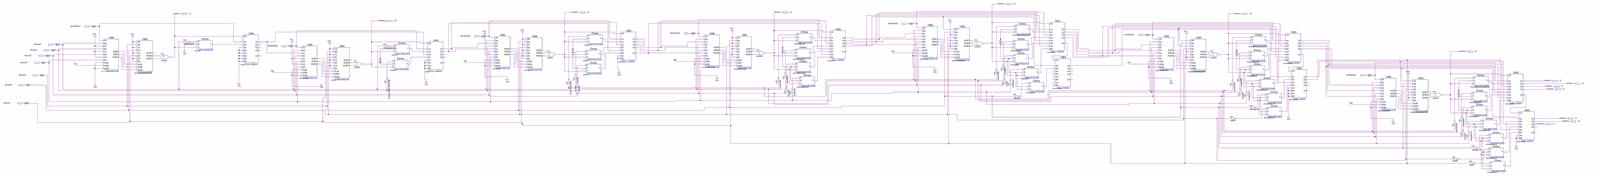
[diagram p0: schematic sheet, whole]
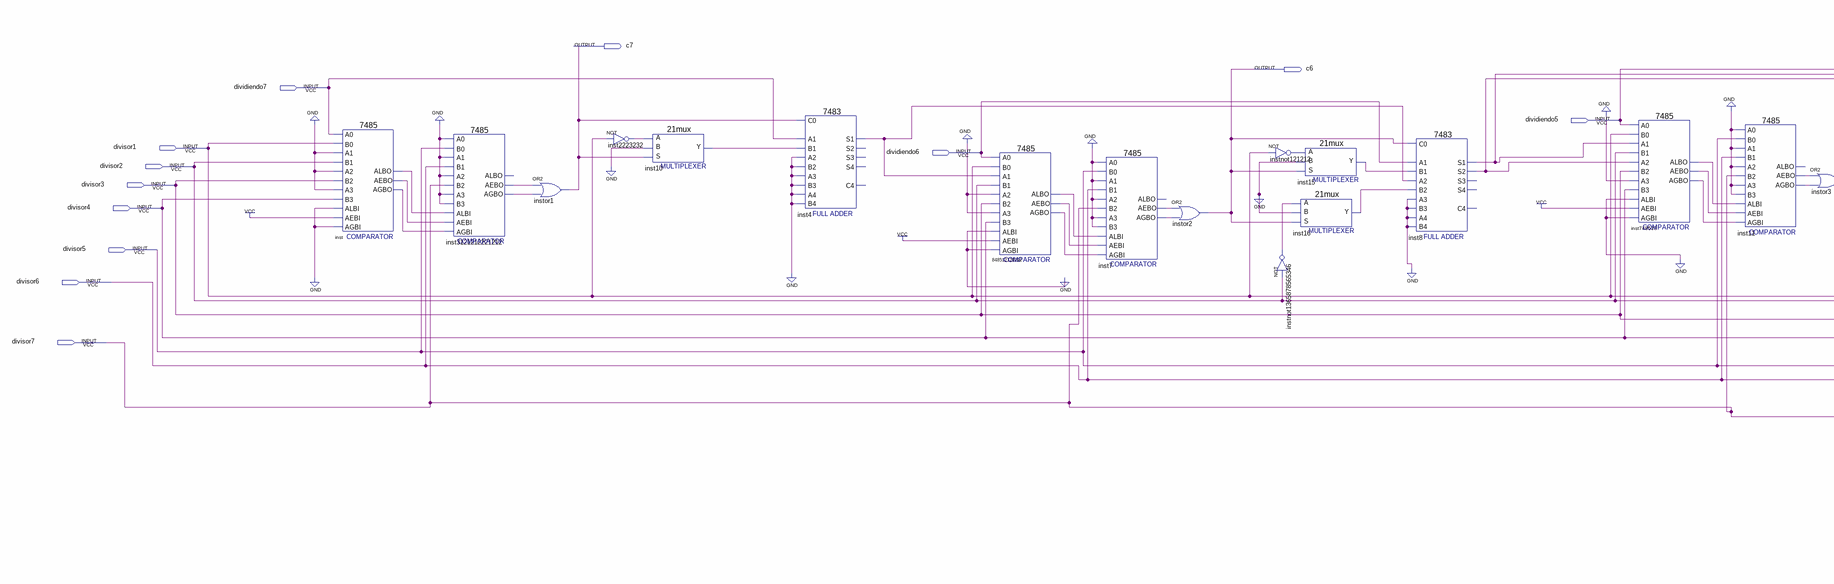
[diagram p1: schematic sheet, left part]
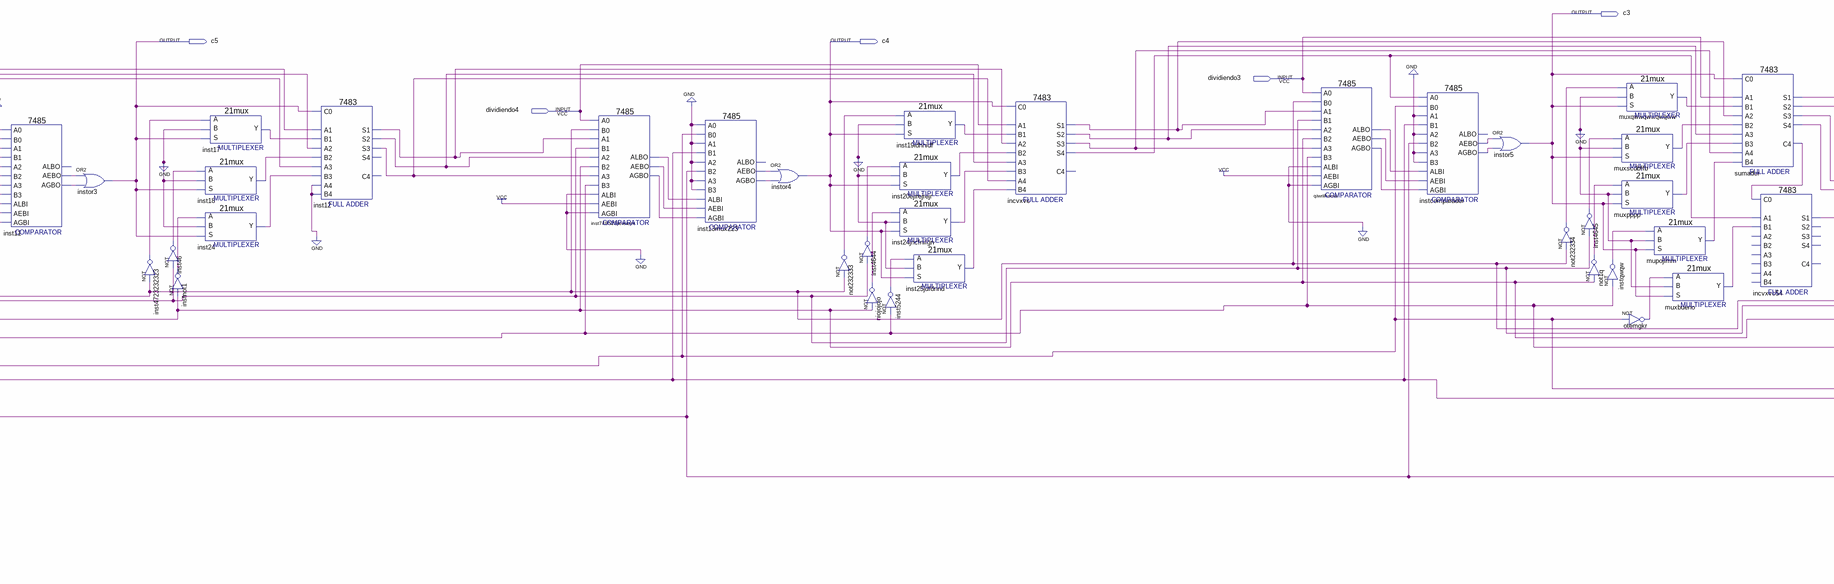
[diagram p2: schematic sheet, centre part]
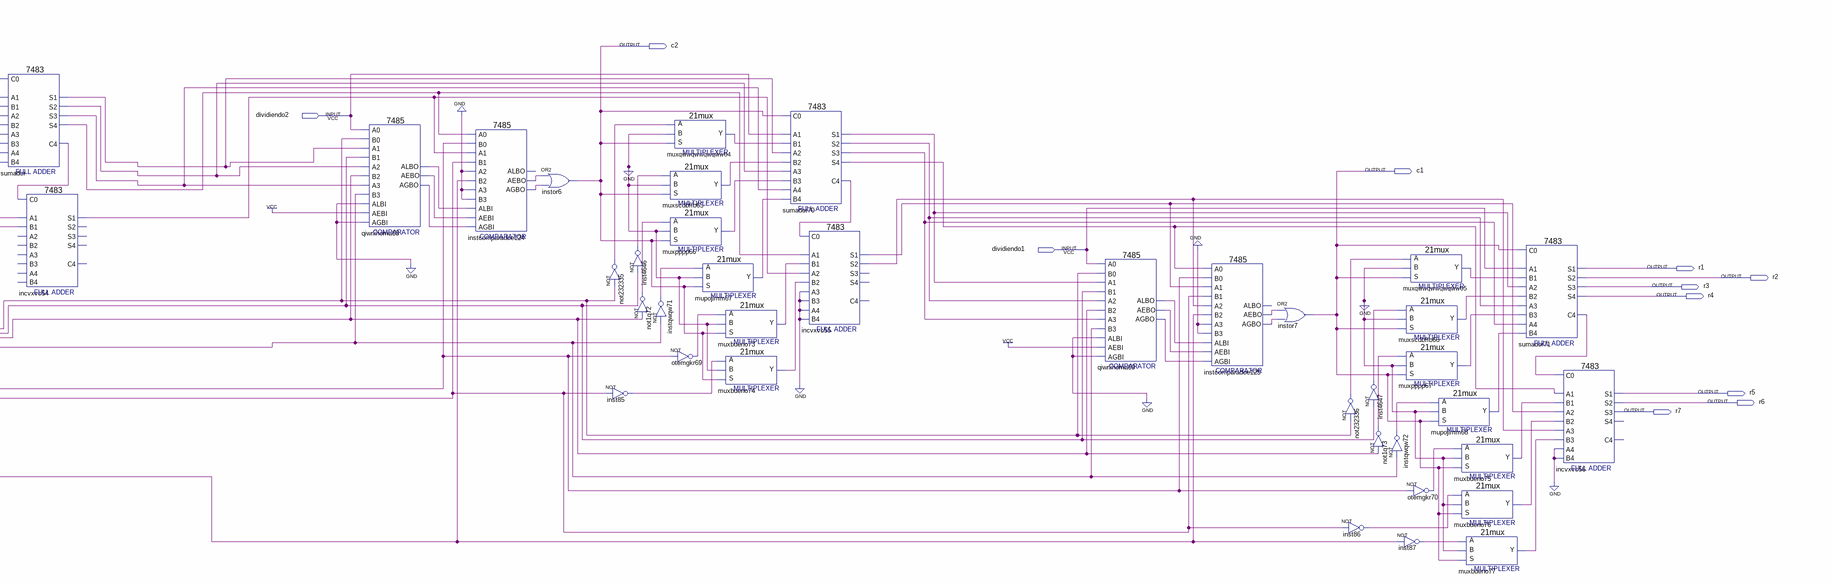
[diagram p3: schematic sheet, right part]
// Quartus schematic divisor.bdf as structural Verilog: 87 symbols, 28 pins
module divisor (
  input  dividiendo3,
  input  dividiendo7,
  input  dividiendo4,
  input  dividiendo2,
  input  dividiendo5,
  input  divisor1,
  input  dividiendo6,
  input  divisor2,
  input  divisor3,
  input  divisor4,
  input  divisor5,
  input  dividiendo1,
  input  divisor6,
  input  divisor7,
  output c3,
  output c5,
  output c4,
  output c7,
  output c2,
  output c6,
  output c1,
  output r1,
  output r2,
  output r3,
  output r4,
  output r5,
  output r6,
  output r7
);

  wire incvxvc54_s1, incvxvc55_s1, incvxvc55_s2, incvxvc_s1, incvxvc_s2, incvxvc_s3, incvxvc_s4, inst4_s1,
       inst7_aebo, inst7_agbo, inst8_s1, inst8_s2, inst10_y, inst11_aebo, inst11_agbo, inst12_s1, inst12_s2,
       inst12_s3, inst13mux223_aebo, inst13mux223_agbo, inst15_y, inst16_y, inst17_y, inst18_y,
       inst19idhhidf_y, inst20ejirejrejr_y, inst24_y, inst24jncfnifgn_y, inst25jdfdnnd_y, inst46_out,
       inst85_out, inst86_out, inst87_out, inst4644_out, inst4645_out, inst4646_out, inst4647_out,
       inst5244_out, inst748523_aebo, inst748523_agbo, inst748523_albo, inst748523jieieiejre_aebo,
       inst748523jieieiejre_agbo, inst748523jieieiejre_albo, inst2223232_out, inst4723232323_out,
       inst3121212221212_aebo, inst3121212221212_agbo, inst_aebo, inst_agbo, inst_albo,
       instcomparadoe124_aebo, instcomparadoe124_agbo, instcomparadoe125_aebo, instcomparadoe125_agbo,
       instcomparador_aebo, instcomparador_agbo, instnot1_out, instnot121212_out, instnot1365878565346_out,
       instqwqw71_out, instqwqw72_out, instqwqw_out, mupojimm67_y, mupojimm68_y, mupojimm_y, muxbueno73_y,
       muxbueno74_y, muxbueno75_y, muxbueno76_y, muxbueno77_y, muxbueno_y, muxpppp66_y, muxpppp67_y,
       muxpppp_y, muxqwwqwwqwqww64_y, muxqwwqwwqwqww65_y, muxqwwqwwqwqww_y, muxscdbffb65_y, muxscdbffb66_y,
       muxscdbffb_y, n848512121212_aebo, n848512121212_agbo, n848512121212_albo, niojojojo_out, not1q72_out,
       not1q73_out, not1q_out, not232333_out, not232334_out, not232335_out, not232336_out, otemgkr69_out,
       otemgkr70_out, otemgkr_out, qiwriihoma68_aebo, qiwriihoma68_agbo, qiwriihoma68_albo,
       qiwriihoma69_aebo, qiwriihoma69_agbo, qiwriihoma69_albo, qiwriihoma_aebo, qiwriihoma_agbo,
       qiwriihoma_albo, sumador70_c4, sumador70_s1, sumador70_s2, sumador70_s3, sumador70_s4, sumador71_c4,
       sumador_c4, sumador_s1, sumador_s2, sumador_s3, sumador_s4;

  \7485  inst (
    .A3(1'b0), .B2(divisor3), .A2(1'b0), .AEBI(1'b1), .AGBI(1'b0), .ALBI(1'b0), .A0(dividiendo7),
    .B0(divisor1), .B3(divisor4), .A1(1'b0), .B1(divisor2), .ALBO(inst_albo), .AGBO(inst_agbo),
    .AEBO(inst_aebo));
  \7485  inst3121212221212 (
    .A3(1'b0), .B2(divisor7), .A2(1'b0), .AEBI(inst_aebo), .AGBI(inst_agbo), .ALBI(inst_albo), .A0(1'b0),
    .B0(divisor5), .B3(1'b0), .A1(1'b0), .B1(divisor6), .AGBO(inst3121212221212_agbo),
    .AEBO(inst3121212221212_aebo));  // open: ALBO
  or instor1 (c7, inst3121212221212_aebo, inst3121212221212_agbo);
  not inst2223232 (inst2223232_out, divisor1);
  \21mux  inst10 (.S(c7), .B(1'b0), .A(inst2223232_out), .Y(inst10_y));
  \7483  inst4 (
    .B4(1'b0), .C0(c7), .A1(dividiendo7), .A2(1'b0), .B1(inst10_y), .B2(1'b0), .A3(1'b0), .B3(1'b0),
    .A4(1'b0), .S1(inst4_s1));  // open: S3, S4, S2, C4
  \7485  u_848512121212 (
    .A3(1'b0), .B2(divisor3), .A2(1'b0), .AEBI(1'b1), .AGBI(1'b0), .ALBI(1'b0), .A0(dividiendo6),
    .B0(divisor1), .B3(divisor4), .A1(inst4_s1), .B1(divisor2), .ALBO(n848512121212_albo),
    .AGBO(n848512121212_agbo), .AEBO(n848512121212_aebo));
  \7485  inst7 (
    .A3(1'b0), .B2(divisor7), .A2(1'b0), .AEBI(n848512121212_aebo), .AGBI(n848512121212_agbo),
    .ALBI(n848512121212_albo), .A0(1'b0), .B0(divisor5), .B3(1'b0), .A1(1'b0), .B1(divisor6),
    .AGBO(inst7_agbo), .AEBO(inst7_aebo));  // open: ALBO
  or instor2 (c6, inst7_aebo, inst7_agbo);
  not instnot121212 (instnot121212_out, divisor1);
  \21mux  inst16 (.S(c6), .B(1'b0), .A(instnot1365878565346_out), .Y(inst16_y));
  not instnot1365878565346 (instnot1365878565346_out, divisor2);
  \21mux  inst15 (.S(c6), .B(1'b0), .A(instnot121212_out), .Y(inst15_y));
  \7483  inst8 (
    .B4(1'b0), .C0(c6), .A1(dividiendo6), .A2(inst4_s1), .B1(inst15_y), .B2(inst16_y), .A3(1'b0), .B3(1'b0),
    .A4(1'b0), .S2(inst8_s2), .S1(inst8_s1));  // open: S3, S4, C4
  \7485  inst748523 (
    .A3(1'b0), .B2(divisor3), .A2(inst8_s2), .AEBI(1'b1), .AGBI(1'b0), .ALBI(1'b0), .A0(dividiendo5),
    .B0(divisor1), .B3(divisor4), .A1(inst8_s1), .B1(divisor2), .ALBO(inst748523_albo),
    .AGBO(inst748523_agbo), .AEBO(inst748523_aebo));
  \7485  inst11 (
    .A3(1'b0), .B2(divisor7), .A2(1'b0), .AEBI(inst748523_aebo), .AGBI(inst748523_agbo),
    .ALBI(inst748523_albo), .A0(1'b0), .B0(divisor5), .B3(1'b0), .A1(1'b0), .B1(divisor6),
    .AGBO(inst11_agbo), .AEBO(inst11_aebo));  // open: ALBO
  or instor3 (c5, inst11_aebo, inst11_agbo);
  not inst4723232323 (inst4723232323_out, divisor1);
  not inst46 (inst46_out, divisor2);
  not instnot1 (instnot1_out, divisor3);
  \21mux  inst17 (.S(c5), .B(1'b0), .A(inst4723232323_out), .Y(inst17_y));
  \21mux  inst18 (.S(c5), .B(1'b0), .A(inst46_out), .Y(inst18_y));
  \21mux  inst24 (.S(c5), .B(1'b0), .A(instnot1_out), .Y(inst24_y));
  \7483  inst12 (
    .B4(1'b0), .C0(c5), .A1(dividiendo5), .A2(inst8_s1), .B1(inst17_y), .B2(inst18_y), .A3(inst8_s2),
    .B3(inst24_y), .A4(1'b0), .S3(inst12_s3), .S2(inst12_s2), .S1(inst12_s1));  // open: S4, C4
  \7485  inst748523jieieiejre (
    .A3(inst12_s3), .B2(divisor3), .A2(inst12_s2), .AEBI(1'b1), .AGBI(1'b0), .ALBI(1'b0), .A0(dividiendo4),
    .B0(divisor1), .B3(divisor4), .A1(inst12_s1), .B1(divisor2), .ALBO(inst748523jieieiejre_albo),
    .AGBO(inst748523jieieiejre_agbo), .AEBO(inst748523jieieiejre_aebo));
  \7485  inst13mux223 (
    .A3(1'b0), .B2(divisor7), .A2(1'b0), .AEBI(inst748523jieieiejre_aebo), .AGBI(inst748523jieieiejre_agbo),
    .ALBI(inst748523jieieiejre_albo), .A0(1'b0), .B0(divisor5), .B3(1'b0), .A1(1'b0), .B1(divisor6),
    .AGBO(inst13mux223_agbo), .AEBO(inst13mux223_aebo));  // open: ALBO
  or instor4 (c4, inst13mux223_aebo, inst13mux223_agbo);
  not not232333 (not232333_out, divisor1);
  \21mux  inst20ejirejrejr (.S(c4), .B(1'b0), .A(inst4644_out), .Y(inst20ejirejrejr_y));
  \21mux  inst24jncfnifgn (.S(c4), .B(1'b0), .A(niojojojo_out), .Y(inst24jncfnifgn_y));
  not inst4644 (inst4644_out, divisor2);
  not niojojojo (niojojojo_out, divisor3);
  not inst5244 (inst5244_out, divisor4);
  \21mux  inst19idhhidf (.S(c4), .B(1'b0), .A(not232333_out), .Y(inst19idhhidf_y));
  \21mux  inst25jdfdnnd (.S(c4), .B(1'b0), .A(inst5244_out), .Y(inst25jdfdnnd_y));
  \7483  incvxvc (
    .B4(inst25jdfdnnd_y), .C0(c4), .A1(dividiendo4), .A2(inst12_s1), .B1(inst19idhhidf_y),
    .B2(inst20ejirejrejr_y), .A3(inst12_s2), .B3(inst24jncfnifgn_y), .A4(inst12_s3), .S3(incvxvc_s3),
    .S4(incvxvc_s4), .S2(incvxvc_s2), .S1(incvxvc_s1));  // open: C4
  \7485  qiwriihoma (
    .A3(incvxvc_s3), .B2(divisor3), .A2(incvxvc_s2), .AEBI(1'b1), .AGBI(1'b0), .ALBI(1'b0), .A0(dividiendo3),
    .B0(divisor1), .B3(divisor4), .A1(incvxvc_s1), .B1(divisor2), .ALBO(qiwriihoma_albo),
    .AGBO(qiwriihoma_agbo), .AEBO(qiwriihoma_aebo));
  \7485  instcomparador (
    .A3(1'b0), .B2(divisor7), .A2(1'b0), .AEBI(qiwriihoma_aebo), .AGBI(qiwriihoma_agbo),
    .ALBI(qiwriihoma_albo), .A0(incvxvc_s4), .B0(divisor5), .B3(1'b0), .A1(1'b0), .B1(divisor6),
    .AGBO(instcomparador_agbo), .AEBO(instcomparador_aebo));  // open: ALBO
  or instor5 (c3, instcomparador_aebo, instcomparador_agbo);
  not not232334 (not232334_out, divisor1);
  not inst4645 (inst4645_out, divisor2);
  not not1q (not1q_out, divisor3);
  \21mux  muxqwwqwwqwqww (.S(c3), .B(1'b0), .A(not232334_out), .Y(muxqwwqwwqwqww_y));
  \21mux  muxscdbffb (.S(c3), .B(1'b0), .A(inst4645_out), .Y(muxscdbffb_y));
  \21mux  muxpppp (.S(c3), .B(1'b0), .A(not1q_out), .Y(muxpppp_y));
  not instqwqw (instqwqw_out, divisor4);
  not otemgkr (otemgkr_out, divisor5);
  \21mux  mupojimm (.S(c3), .B(1'b0), .A(instqwqw_out), .Y(mupojimm_y));
  \21mux  muxbueno (.S(c3), .B(1'b0), .A(otemgkr_out), .Y(muxbueno_y));
  \7483  sumador (
    .B4(mupojimm_y), .C0(c3), .A1(dividiendo3), .A2(incvxvc_s1), .B1(muxqwwqwwqwqww_y), .B2(muxscdbffb_y),
    .A3(incvxvc_s2), .B3(muxpppp_y), .A4(incvxvc_s3), .S3(sumador_s3), .S4(sumador_s4), .S2(sumador_s2),
    .C4(sumador_c4), .S1(sumador_s1));
  \7483  incvxvc54 (
    .C0(sumador_c4), .A1(incvxvc_s4), .B1(muxbueno_y), .S1(incvxvc54_s1));  // open: B4, A2, B2, A3, B3, A4, S3, S4, S2, C4
  \7485  qiwriihoma68 (
    .A3(sumador_s3), .B2(divisor3), .A2(sumador_s2), .AEBI(1'b1), .AGBI(1'b0), .ALBI(1'b0), .A0(dividiendo2),
    .B0(divisor1), .B3(divisor4), .A1(sumador_s1), .B1(divisor2), .ALBO(qiwriihoma68_albo),
    .AGBO(qiwriihoma68_agbo), .AEBO(qiwriihoma68_aebo));
  \7485  instcomparadoe124 (
    .A3(1'b0), .B2(divisor7), .A2(1'b0), .AEBI(qiwriihoma68_aebo), .AGBI(qiwriihoma68_agbo),
    .ALBI(qiwriihoma68_albo), .A0(sumador_s4), .B0(divisor5), .B3(1'b0), .A1(incvxvc54_s1), .B1(divisor6),
    .AGBO(instcomparadoe124_agbo), .AEBO(instcomparadoe124_aebo));  // open: ALBO
  or instor6 (c2, instcomparadoe124_aebo, instcomparadoe124_agbo);
  not inst4646 (inst4646_out, divisor2);
  not not232335 (not232335_out, divisor1);
  not not1q72 (not1q72_out, divisor3);
  not inst85 (inst85_out, divisor6);
  \21mux  muxqwwqwwqwqww64 (.S(c2), .B(1'b0), .A(not232335_out), .Y(muxqwwqwwqwqww64_y));
  \21mux  muxscdbffb65 (.S(c2), .B(1'b0), .A(inst4646_out), .Y(muxscdbffb65_y));
  \21mux  muxpppp66 (.S(c2), .B(1'b0), .A(not1q72_out), .Y(muxpppp66_y));
  not instqwqw71 (instqwqw71_out, divisor4);
  not otemgkr69 (otemgkr69_out, divisor5);
  \21mux  mupojimm67 (.S(c2), .B(1'b0), .A(instqwqw71_out), .Y(mupojimm67_y));
  \21mux  muxbueno73 (.S(c2), .B(1'b0), .A(otemgkr69_out), .Y(muxbueno73_y));
  \21mux  muxbueno74 (.S(c2), .B(1'b0), .A(inst85_out), .Y(muxbueno74_y));
  \7483  sumador70 (
    .B4(mupojimm67_y), .C0(c2), .A1(dividiendo2), .A2(sumador_s1), .B1(muxqwwqwwqwqww64_y),
    .B2(muxscdbffb65_y), .A3(sumador_s2), .B3(muxpppp66_y), .A4(sumador_s3), .S3(sumador70_s3),
    .S4(sumador70_s4), .S2(sumador70_s2), .C4(sumador70_c4), .S1(sumador70_s1));
  \7483  incvxvc55 (
    .B4(1'b0), .C0(sumador70_c4), .A1(sumador_s4), .A2(incvxvc54_s1), .B1(muxbueno73_y), .B2(muxbueno74_y),
    .A3(1'b0), .B3(1'b0), .A4(1'b0), .S2(incvxvc55_s2), .S1(incvxvc55_s1));  // open: S3, S4, C4
  \7485  qiwriihoma69 (
    .A3(sumador70_s3), .B2(divisor3), .A2(sumador70_s2), .AEBI(1'b1), .AGBI(1'b0), .ALBI(1'b0),
    .A0(dividiendo1), .B0(divisor1), .B3(divisor4), .A1(sumador70_s1), .B1(divisor2),
    .ALBO(qiwriihoma69_albo), .AGBO(qiwriihoma69_agbo), .AEBO(qiwriihoma69_aebo));
  \7485  instcomparadoe125 (
    .A3(1'b0), .B2(divisor7), .A2(incvxvc55_s2), .AEBI(qiwriihoma69_aebo), .AGBI(qiwriihoma69_agbo),
    .ALBI(qiwriihoma69_albo), .A0(sumador70_s4), .B0(divisor5), .B3(1'b0), .A1(incvxvc55_s1), .B1(divisor6),
    .AGBO(instcomparadoe125_agbo), .AEBO(instcomparadoe125_aebo));  // open: ALBO
  or instor7 (c1, instcomparadoe125_aebo, instcomparadoe125_agbo);
  not not232336 (not232336_out, divisor1);
  not inst86 (inst86_out, divisor6);
  not inst4647 (inst4647_out, divisor2);
  not not1q73 (not1q73_out, divisor3);
  \21mux  muxqwwqwwqwqww65 (.S(c1), .B(1'b0), .A(not232336_out), .Y(muxqwwqwwqwqww65_y));
  \21mux  muxscdbffb66 (.S(c1), .B(1'b0), .A(inst4647_out), .Y(muxscdbffb66_y));
  \21mux  muxpppp67 (.S(c1), .B(1'b0), .A(not1q73_out), .Y(muxpppp67_y));
  not instqwqw72 (instqwqw72_out, divisor4);
  not otemgkr70 (otemgkr70_out, divisor5);
  not inst87 (inst87_out, divisor7);
  \21mux  mupojimm68 (.S(c1), .B(1'b0), .A(instqwqw72_out), .Y(mupojimm68_y));
  \21mux  muxbueno75 (.S(c1), .B(1'b0), .A(otemgkr70_out), .Y(muxbueno75_y));
  \21mux  muxbueno76 (.S(c1), .B(1'b0), .A(inst86_out), .Y(muxbueno76_y));
  \21mux  muxbueno77 (.S(c1), .B(1'b0), .A(inst87_out), .Y(muxbueno77_y));
  \7483  sumador71 (
    .B4(mupojimm68_y), .C0(c1), .A1(dividiendo1), .A2(sumador70_s1), .B1(muxqwwqwwqwqww65_y),
    .B2(muxscdbffb66_y), .A3(sumador70_s2), .B3(muxpppp67_y), .A4(sumador70_s3), .S3(r3), .S4(r4), .S2(r2),
    .C4(sumador71_c4), .S1(r1));
  \7483  incvxvc56 (
    .B4(1'b0), .C0(sumador71_c4), .A1(sumador70_s4), .A2(incvxvc55_s1), .B1(muxbueno75_y), .B2(muxbueno76_y),
    .A3(incvxvc55_s2), .B3(muxbueno77_y), .A4(1'b0), .S3(r7), .S2(r6), .S1(r5));  // open: S4, C4
endmodule
